# Altium schematic sheet Sheet3.SchDoc
size A
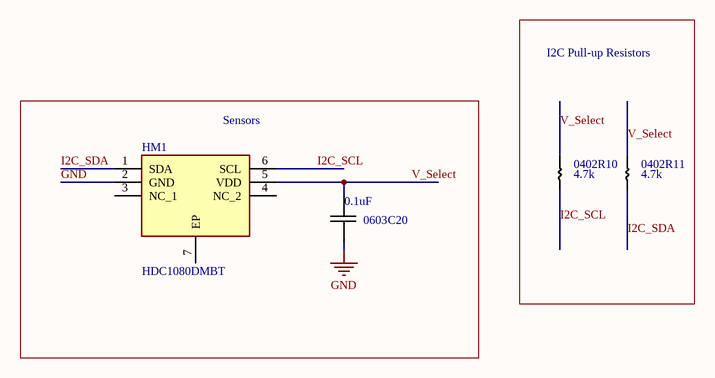
[diagram p0: Sheet3.SchDoc]

## Parts
C20  0.1uF  [0603_SMD]
HM1  HDC1080DMBT  [SON100P300X300X80-7N]
R10  4.7k  [0402_SMD]
R11  4.7k  [0402_SMD]

## Blocks framed on the sheet
I2C Pull-up Resistors: R10 R11
Sensors: C20 HM1

## Nets
GND: C20.1 HM1.2(GND)
I2C_SCL: HM1.6(SCL) R10.2
I2C_SDA: HM1.1(SDA) R11.2
V_Select: C20.2 HM1.5(VDD) R10.1 R11.1

Not connected (* = marked no-connect by the designer): HM1 3(NC_1) 4(NC_2) 7(EP)

## Notes on the sheet
- (in symbol C_0603) 0603
- (in symbol R_0402) 0402

## Library data of the parts
C20 = C_0603
HM1 = HDC1080DMBT: Hygrometer; Manufacturer_Name: Texas Instruments; Datasheet Link: http://www.mouser.com/ds/2/405/hdc1080-844688.pdf; Height: 0.8mm; Manufacturer_Part_Number: HDC1080DMBT; Mouser Part Number: 595-HDC1080DMBT; Mouser Price/Stock: https://www.mouser.com/Search/Refine.aspx?Keyword=595-HDC1080DMBT; RS Part Number: 1330170P; RS Price/Stock: http://uk.rs-online.com/web/p/products/1330170P
R10 R11 = R_0402